# EAGLE design TricolorShield (EAGLE 7.2.0)
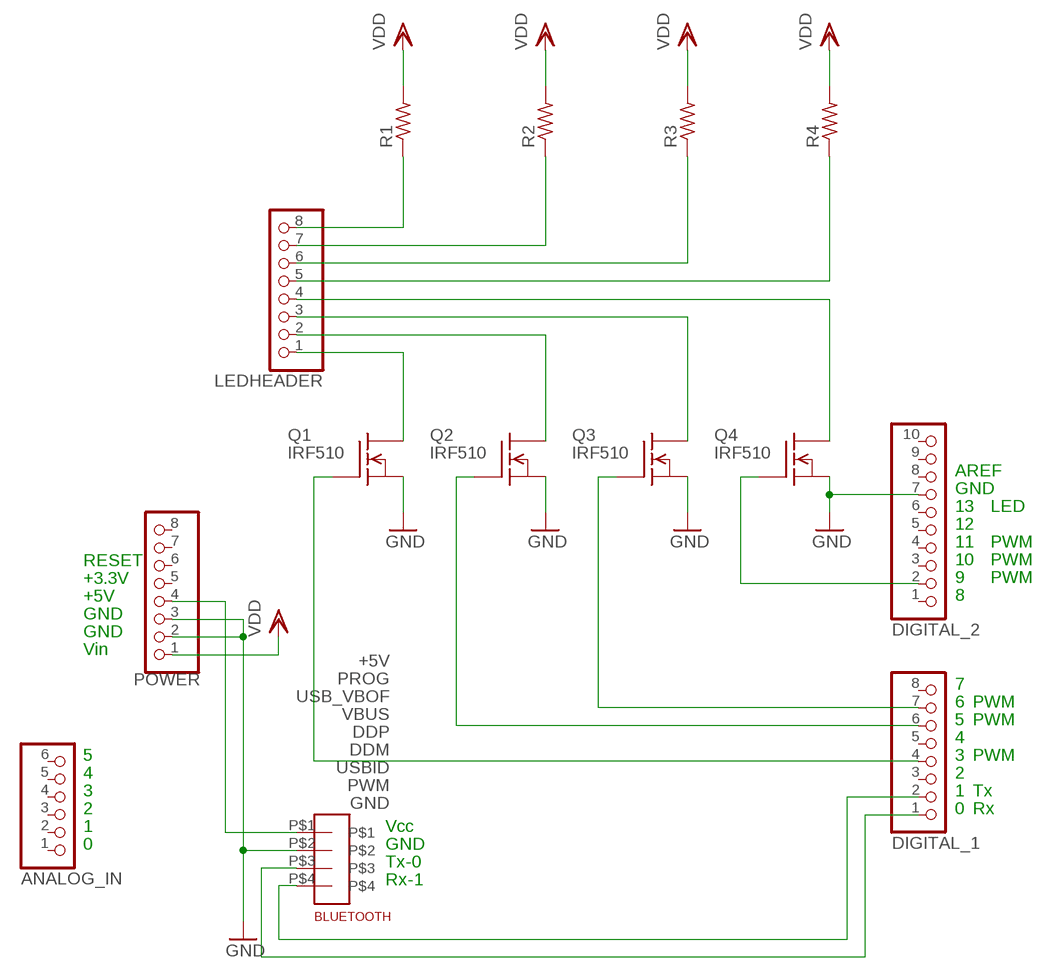
[diagram p0: schematic, sheet 1]

## Parts
ANALOG_IN  PINHD-1X6TH  [1X06-TH]
BLUETOOTH  4PADS_ROBBIE  [1X04_ROBBIE]
DIGITAL_1  PINHD-1X8TH  [1X08-TH]
DIGITAL_2  PINHD-1X10TH  [1X10-TH]
LEDHEADER  PINHD-1X8TH  [1X08-TH]
POWER  PINHD-1X8TH  [1X08-TH]
Q1  IRF510  [TO220]
Q2  IRF510  [TO220]
Q3  IRF510  [TO220]
Q4  IRF510  [TO220]
R1  R-US_0922/22  [0922/22]
R2  R-US_0922/22  [0922/22]
R3  R-US_0922/22  [0922/22]
R4  R-US_0922/22  [0922/22]

## Nets
GND: BLUETOOTH.P$2 DIGITAL_2.7 POWER.2 POWER.3 Q1.3(S) Q2.3(S) Q3.3(S) Q4.3(S)
N$1: DIGITAL_1.4 Q1.1(G)
N$2: LEDHEADER.8 R1.1
N$3: LEDHEADER.1 Q1.2(D)
N$4: LEDHEADER.7 R2.1
N$5: DIGITAL_1.6 Q2.1(G)
N$6: DIGITAL_1.7 Q3.1(G)
N$7: DIGITAL_2.2 Q4.1(G)
N$8: LEDHEADER.2 Q2.2(D)
N$9: LEDHEADER.6 R3.1
N$10: LEDHEADER.3 Q3.2(D)
N$11: LEDHEADER.5 R4.1
N$12: LEDHEADER.4 Q4.2(D)
N$13: BLUETOOTH.P$3 DIGITAL_1.1
N$14: BLUETOOTH.P$1 POWER.4
N$15: BLUETOOTH.P$4 DIGITAL_1.2
VDD: POWER.1 R1.2 R2.2 R3.2 R4.2
Unconnected: ANALOG_IN.1 ANALOG_IN.2 ANALOG_IN.3 ANALOG_IN.4 ANALOG_IN.5 ANALOG_IN.6 DIGITAL_1.3 DIGITAL_1.5 DIGITAL_1.8 DIGITAL_2.1 DIGITAL_2.3 DIGITAL_2.4 DIGITAL_2.5 DIGITAL_2.6 DIGITAL_2.8 DIGITAL_2.9 DIGITAL_2.10 POWER.5 POWER.6 POWER.7 POWER.8

## Notes on the sheet
- AREF
- GND
- 13 | LED
- 12
- 11 | PWM
- RESET | 10 | PWM
- +3.3V | 9 | PWM
- +5V | 8
- GND
- GND
- Vin | +5V
- PROG
- USB_VBOF | 7
- VBUS | 6 | PWM
- DDP | 5 | PWM
- DDM | 4
- 5 | USBID | 3 | PWM
- 4 | PWM | 2
- 3 | GND | 1 | Tx
- 2 | 0 | Rx
- 1 | Vcc
- 0 | GND
- Tx-0
- Rx-1

## Library data of the parts
ANALOG_IN = SmartPrj:PINHD-1X6: PIN HEADER
BLUETOOTH = robbie:4PADS_ROBBIE
DIGITAL_1 LEDHEADER POWER = SmartPrj:PINHD-1X8: PIN HEADER
DIGITAL_2 = SmartPrj:PINHD-1X10: PIN HEADER
Q1-Q4 = transistor-fet:IRF510: N-Channel Enhancement MOSFET (HEXFET); 100V; 5,6A; 0,54Ohm
R1-R4 = resistor:R-US_: RESISTOR, American symbol

## Net classes
0 default: width 0.406 mm, drill 0.406 mm, clearance 0.305 mm
1 power: width 0.254 mm, drill 0.61 mm, clearance 0.203 mm
2 VIN: width 0.61 mm, drill 0.813 mm, clearance 0.305 mm
3 usbvcc: width 0.508 mm, drill 0.508 mm, clearance 0.152 mm
4 aref: width 0.406 mm

## Board
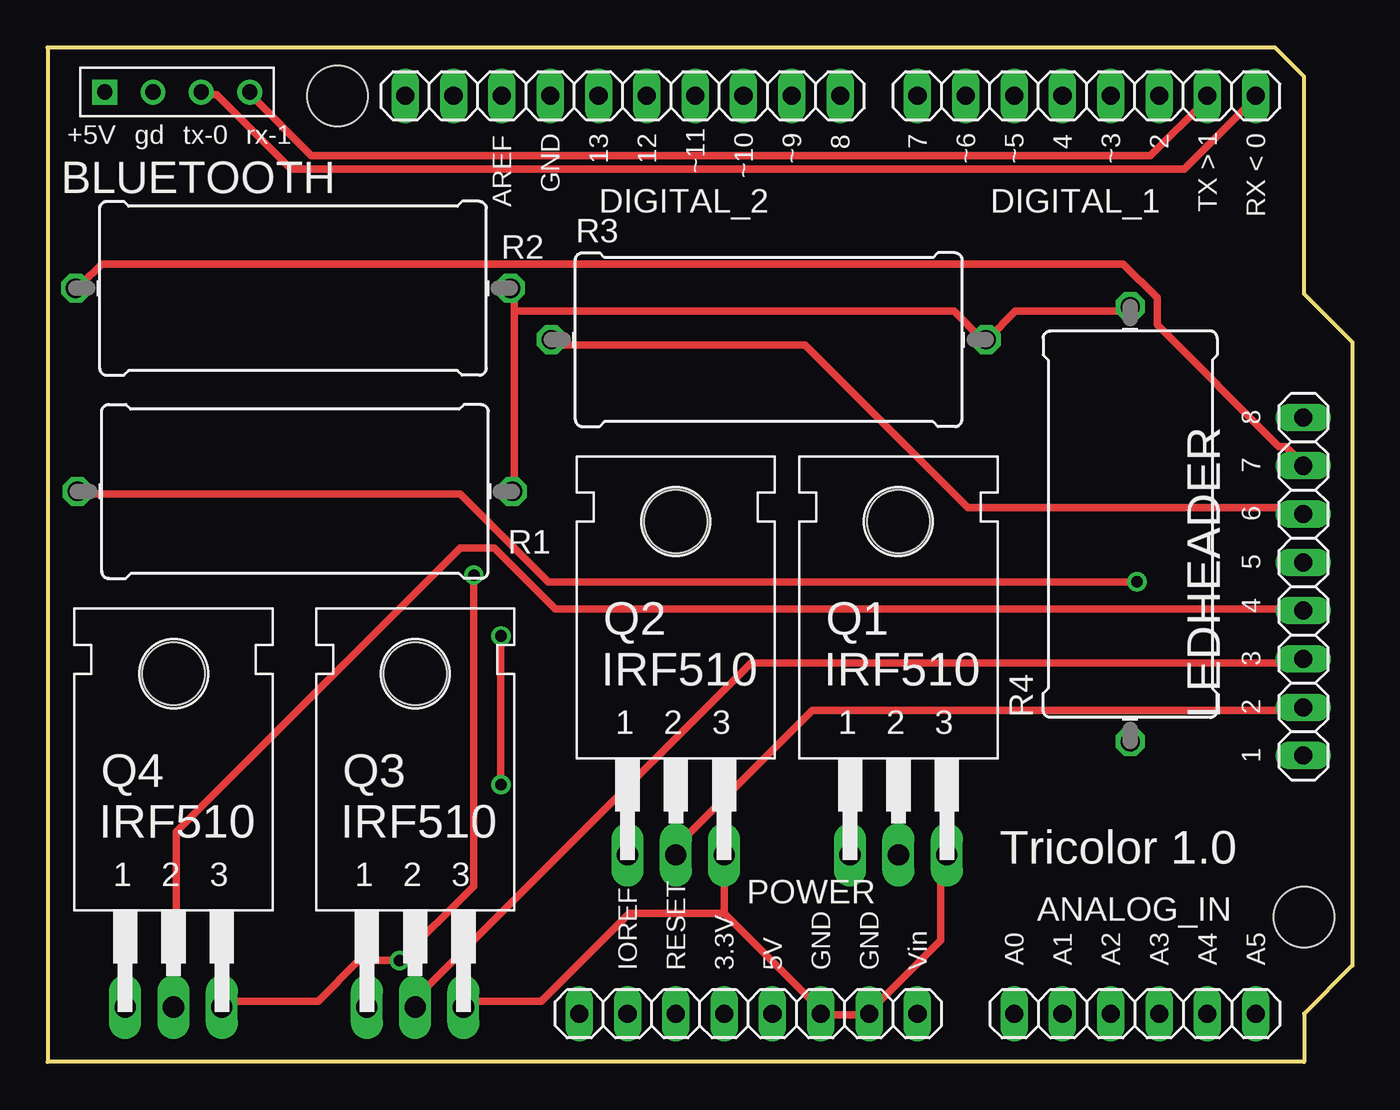
[diagram p1: board, top side]
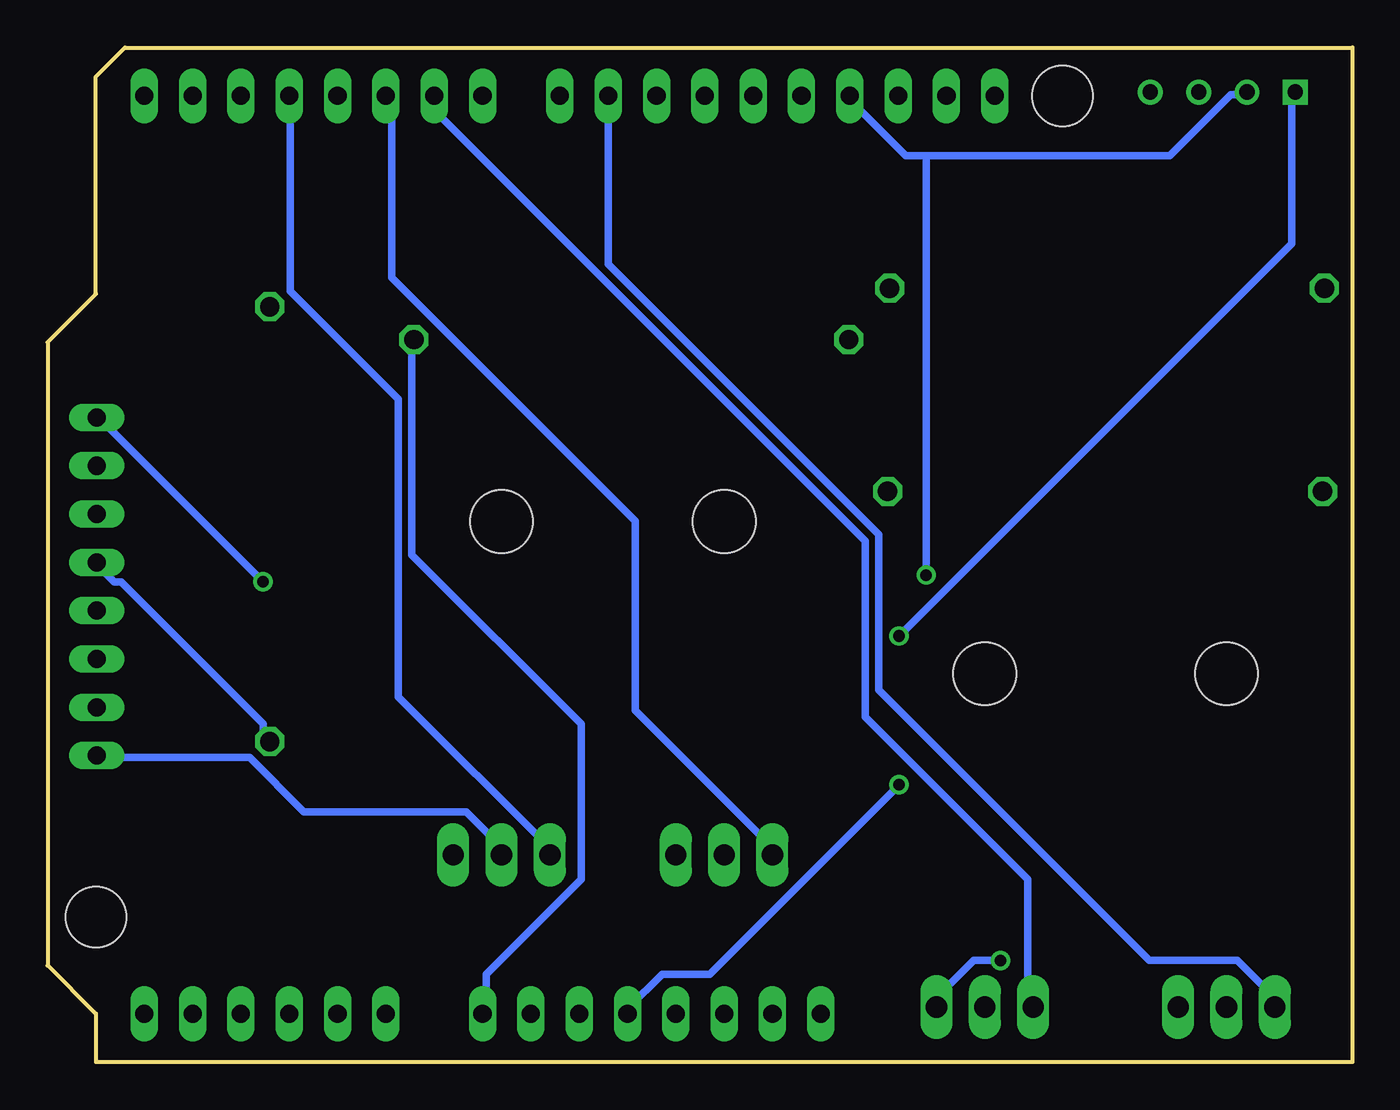
[diagram p2: board, bottom side, seen from below]

Size 68.58 x 53.34 mm. Coordinates in mm from the lower left corner, seen from the top.
Outline: 66.04,51.82 64.52,53.34 0,53.34 0,0 66.04,0 66.04,2.54 68.58,5.08 68.58,37.85 66.04,40.39 66.04,51.82
Copper layers (1*16): Top 0.035mm / dielectric 1.5mm / Bottom 0.035mm
Design rules "default": minimum track width 10mil, minimum drill 24mil, track to track 8mil, track to pad 8mil, pad to pad 8mil, via to via 8mil, smd to smd 8mil, copper to edge 40mil, drill to drill 8mil, minimum pad ring 10mil, minimum via ring 8mil, stop-mask expansion 4mil, vias tented up to drill 0mil, thermal gap 10mil
Holes 3.17 mm at 15.24,50.8 66.04,7.62

### Footprints (pad centres in the part's own frame; a part is rotated, then mirrored left to right if it is on the bottom)
1X06-TH = drill 0.95 pad 1.422 long: 1 -6.35,0; 2 -3.81,0; 3 -1.27,0; 4 1.27,0; 5 3.81,0; 6 6.35,0
1X04_ROBBIE = drill 0.8 square: P$1 0,0 | drill 0.8: P$2 2.54,0; P$3 5.08,0; P$4 7.62,0
1X08-TH = drill 0.95 pad 1.422 long: 1 -8.89,0; 2 -6.35,0; 3 -3.81,0; 4 -1.27,0; 5 1.27,0; 6 3.81,0; 7 6.35,0; 8 8.89,0
1X10-TH = drill 0.95 pad 1.422 long: 1 -11.43,0; 2 -8.89,0; 3 -6.35,0; 4 -3.81,0; 5 -1.27,0; 6 1.27,0; 7 3.81,0; 8 6.35,0; 9 8.89,0; 10 11.43,0
TO220 = drill 1.118 long: 1 -2.54,-6.35; 2 0,-6.35; 3 2.54,-6.35 | hole 3.302: 0,11.176
0922/22 = drill 1.016 octagon: 1 -11.43,0; 2 11.43,0

### Placement (x,y rotation side)
ANALOG_IN  57.15,2.54 0 top
BLUETOOTH  3,51 0 top
DIGITAL_1  54.61,50.8 180 top
DIGITAL_2  30.23,50.8 180 top
LEDHEADER  66,25 90 top
POWER  36.83,2.54 180 top
Q1  44.72,17.24 0 top
Q2  33.02,17.24 0 top
Q3  19.32,9.24 0 top
Q4  6.62,9.24 0 top
R1  13,30 0 top
R2  12.9,40.68 0 top
R3  37.9,37.98 0 top
R4  56.9,28.28 90 top

### Tracks (layer width: path | path; a pad name or v marks a point on that pad's centre or on a via)
GND  (via drill 0.61)
  Top 0.406: Q4.3 9.25,3.2 14.22,3.2 16.36,5.33 v18.49,5.33 22.4,9.25 v22.4,25.6 | 35.56,7.82 Q2.3 | 35.56,7.82 40.54,2.85 POWER.3 40.89,2.49 43.03,2.49 POWER.2 43.38,2.85 46.94,6.4 46.94,10.67 Q1.3 | 35.56,7.82 30.58,7.82 25.96,3.2 22.05,3.2 Q3.3
  Bottom 0.406: 22.4,47.65 23.47,47.65 26.31,50.49 DIGITAL_2.7 | 22.4,47.65 9.6,47.65 6.4,50.85 5.69,50.85 BLUETOOTH.P$2 | v18.49,5.33 19.91,5.33 22.05,3.2 Q3.3 | v22.4,25.6 22.4,47.65
N$1
  Bottom 0.406: DIGITAL_1.4 55.83,50.49 55.83,40.54 50.14,34.85 50.14,19.2 41.96,11.02 Q1.1
N$2  (via drill 0.61)
  Top 0.406: v57.25,25.25 26.31,25.25 21.69,29.87 1.78,29.87 R1.1
  Bottom 0.406: v57.25,25.25 65.79,33.78 LEDHEADER.8
N$3
  Bottom 0.406: LEDHEADER.1 65.79,16 57.96,16 55.12,13.16 46.58,13.16 44.45,11.02 Q1.2
N$4
  Top 0.406: LEDHEADER.7 65.79,31.65 65.08,32.36 64.72,32.36 58.32,38.76 58.32,40.18 56.54,41.96 2.85,41.96 1.78,40.89 R2.1
N$5
  Bottom 0.406: DIGITAL_1.6 50.49,50.49 50.49,41.25 37.69,28.45 37.69,18.49 30.23,11.02 Q2.1
N$6
  Bottom 0.406: DIGITAL_1.7 48.01,50.49 48.01,49.78 25.6,27.38 25.6,18.14 17.07,9.6 17.07,3.2 Q3.1
N$7
  Bottom 0.406: DIGITAL_2.2 39.12,41.96 24.89,27.74 24.89,19.56 10.67,5.33 6.04,5.33 3.91,3.2 Q4.1
N$8
  Top 0.406: LEDHEADER.2 65.79,18.49 40.18,18.49 32.72,11.02 Q2.2
N$9
  Top 0.406: LEDHEADER.6 65.79,29.16 48.36,29.16 39.83,37.69 26.67,37.69 R3.1
N$10
  Top 0.406: LEDHEADER.3 65.79,20.98 36.98,20.98 19.2,3.2 Q3.2
N$11
  Bottom 0.406: LEDHEADER.5 65.79,25.96 65.08,25.25 64.72,25.25 57.25,17.78 57.25,17.07 R4.1
N$12
  Top 0.406: LEDHEADER.4 65.79,23.82 26.67,23.82 23.47,27.03 21.69,27.03 6.76,12.09 6.76,3.2 Q4.2
N$13
  Top 0.406: BLUETOOTH.P$3 8.18,50.85 8.89,50.85 12.8,46.94 59.74,46.94 63.3,50.49 DIGITAL_1.1
N$14  (via drill 0.61)
  Top 0.406: v23.82,14.58 v23.82,22.4
  Bottom 0.406: v23.82,22.4 3.2,43.03 3.2,50.85 BLUETOOTH.P$1 | v23.82,14.58 33.78,4.62 36.27,4.62 38.05,2.85 POWER.4
N$15
  Top 0.406: BLUETOOTH.P$4 10.67,50.85 13.87,47.65 57.96,47.65 60.81,50.49 DIGITAL_1.2
VDD
  Top 0.406: 24.54,39.47 24.54,40.54 R2.2 | 24.54,39.47 24.54,30.23 R1.2 | R4.2 56.9,39.47 50.85,39.47 49.43,38.05 R3.2 49.07,38.05 47.65,39.47 24.54,39.47
  Bottom 0.406: POWER.1 45.52,2.85 45.52,4.62 40.54,9.6 40.54,17.78 49.43,26.67 49.43,37.69 R3.2

### Text on the board
tPlace: +5V | gd | tx-0 | rx-1 | 8 | 7 | 4 | 2 | 13 | 12 | ~11 | ~9 | ~6 | ~5 | ~3 | GND | ~10 | AREF | TX > 1 | RX < 0 | 8 | 7 | 6 | 5 | 4 | 3 | 2 | 1 | Tricolor 1.0 | IOREF | RESET | 3.3V | 5V | GND | GND | Vin | A0 | A1 | A2 | A3 | A4 | A5